# Altium schematic sheet ESP32 Processor.SchDoc: ESP32 Microcontroller
size A4; Date: Dec. 29th, 2022; Author: Karl Asseily; DrawnBy: Karl Asseily; DocumentNumber: 202301140903; Revision: 1.2; SheetNumber: 11; SheetTotal: 20; Time: 07:56
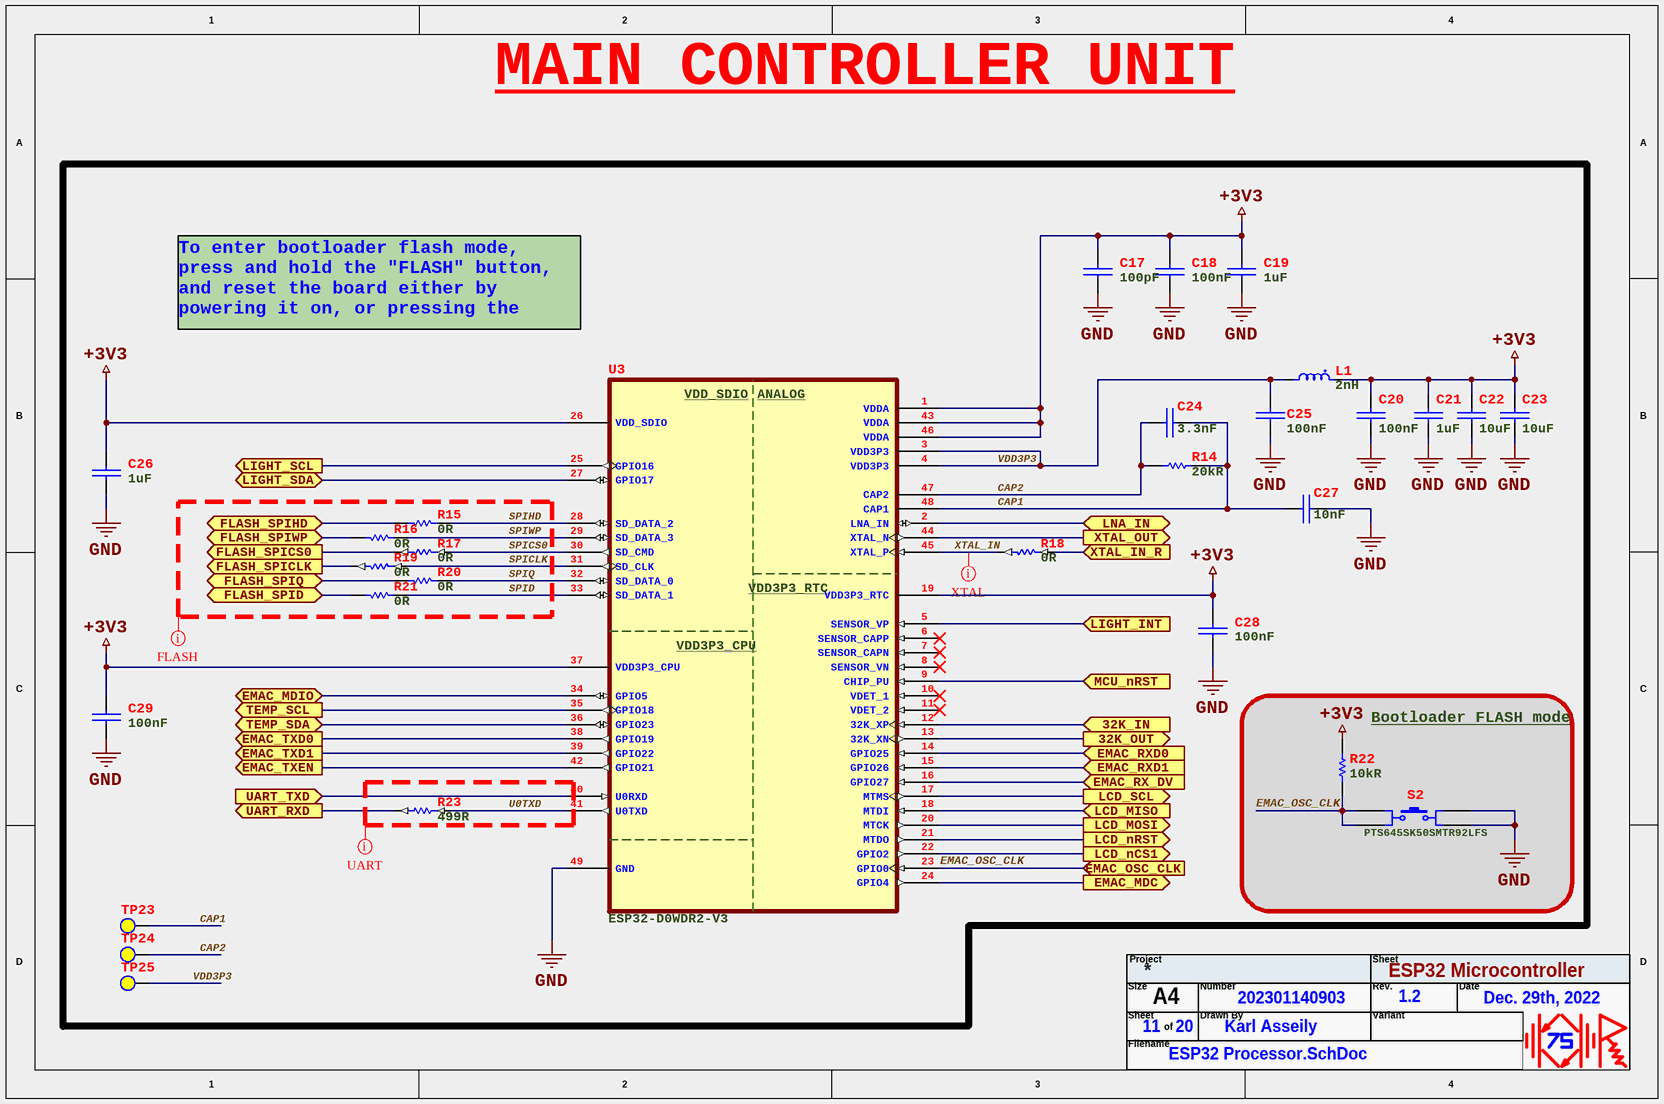
[diagram p0: ESP32 Processor.SchDoc]

## Parts
C17  100pF  [CAP_0603]
C18  100nF  [CAP_0603]
C19  1uF  [CAP_0805]
C20  100nF  [CAP_0603]
C21  1uF  [CAP_0805]
C22  10uF  [CAP_1206]
C23  10uF  [CAP_1206]
C24  3.3nF  [CAP_0603]
C25  100nF  [CAP_0603]
C26  1uF  [CAP_0805]
C27  10nF  [CAP_0603]
C28  100nF  [CAP_0603]
C29  100nF  [CAP_0603]
L1  2nH  [IND_0402]
R14  20kR  [RES_0603]
R15  0R  [RES_0603]
R16  0R  [RES_0603]
R17  0R  [RES_0603]
R18  0R  [RES_0603]
R19  0R  [RES_0603]
R20  0R  [RES_0603]
R21  0R  [RES_0603]
R22  10kR  [RES_0603]
R23  499R  [RES_0603]
S2  PTS645SK50SMTR92LFS  [SW_TACTILE-SPST_PTS645SK50SMTR92LFS_SMD]
TP23  CAP1  [TEST POINT PAD]  (value not drawn)  (no BOM)
TP24  CAP2  [TEST POINT PAD]  (value not drawn)  (no BOM)
TP25  VDD3P3  [TEST POINT PAD]  (value not drawn)  (no BOM)
U3  ESP32-D0WDR2-V3  [IC_QFN35P500X500X90-49N]

## Blocks framed on the sheet
Bootloader FLASH mode: R22 S2

## Ports
32K_IN (in, see Main Controller Unit, RTC Clock), 32K_OUT (out, see Main Controller Unit, RTC Clock), EMAC_MDC (out, see Main Controller Unit, Ethernet Controller, Main Controller Unit), EMAC_MDIO (bidir, see Main Controller Unit, Ethernet Controller, Main Controller Unit), EMAC_OSC_CLK (in, see Main Controller Unit, Ethernet Controller, Main Controller Unit), EMAC_RX_DV (in, see Main Controller Unit, Ethernet Controller, Main Controller Unit), EMAC_RXD0 (in, see Main Controller Unit, Ethernet Controller, Main Controller Unit), EMAC_RXD1 (in, see Main Controller Unit, Ethernet Controller, Main Controller Unit), EMAC_TXD0 (out, see Main Controller Unit, Ethernet Controller, Main Controller Unit), EMAC_TXD1 (out, see Main Controller Unit, Ethernet Controller, Main Controller Unit), EMAC_TXEN (out, see Main Controller Unit, Ethernet Controller, Main Controller Unit), FLASH_SPICLK (out, see Main Controller Unit, Flash Memory), FLASH_SPICS0 (out, see Main Controller Unit, Flash Memory), FLASH_SPID (bidir, see Main Controller Unit, Flash Memory), FLASH_SPIHD (bidir, see Main Controller Unit, Flash Memory), FLASH_SPIQ (bidir, see Main Controller Unit, Flash Memory), FLASH_SPIWP (bidir, see Main Controller Unit, Flash Memory), LCD_MISO (in, see Main Controller Unit, LCD Display, Main Controller Unit), LCD_MOSI (out, see Main Controller Unit, LCD Display, Main Controller Unit), LCD_nCS1 (out, see Main Controller Unit, LCD Display, Main Controller Unit), LCD_nRST (out, see Main Controller Unit, LCD Display, Main Controller Unit), LCD_SCL (out, see Main Controller Unit, LCD Display, Main Controller Unit), LIGHT_INT (in, see Main Controller Unit, Light and Proximity Sensor, Main Controller Unit), LIGHT_SCL (out, see Main Controller Unit, Light and Proximity Sensor, Main Controller Unit), LIGHT_SDA (bidir, see Main Controller Unit, Light and Proximity Sensor, Main Controller Unit), LNA_IN (bidir, see Main Controller Unit, RF Antenna), MCU_nRST (in, see Main Controller Unit, Voltage Supervisor), TEMP_SCL (out, see Main Controller Unit, Temp and Humidity Sensor), TEMP_SDA (bidir, see Main Controller Unit, Temp and Humidity Sensor), UART_RXD (out, see Main Controller Unit, USB-to-Serial Converter), UART_TXD (in, see Main Controller Unit, USB-to-Serial Converter), XTAL_IN_R (in, see Main Controller Unit, CPU Clock), XTAL_OUT (out, see Main Controller Unit, CPU Clock)

## Nets
+3V3: C17.1 C18.1 C19.1 C20.1 C21.1 C22.1 C23.1 C26.1 C28.1 C29.1 L1.1 R22.2 U3.1(VDDA) U3.19(VDD3P3_RTC) U3.26(VDD_SDIO) U3.37(VDD3P3_CPU) U3.43(VDDA) U3.46(VDDA)
GND: C17.2 C18.2 C19.2 C20.2 C21.2 C22.2 C23.2 C25.2 C26.2 C27.2 C28.2 C29.2 S2.3 S2.4 U3.49(GND)
32K_IN: U3.12(32K_XP) ; port 32K_IN
32K_OUT: U3.13(32K_XN) ; port 32K_OUT
CAP1: C24.2 C27.1 R14.2 TP23.TP U3.48(CAP1)
CAP2: C24.1 R14.1 TP24.TP U3.47(CAP2)
EMAC_MDC: U3.24(GPIO4) ; port EMAC_MDC
EMAC_MDIO: U3.34(GPIO5) ; port EMAC_MDIO
EMAC_OSC_CLK: R22.1 S2.1 S2.2 U3.23(GPIO0) ; port EMAC_OSC_CLK
EMAC_RX_DV: U3.16(GPIO27) ; port EMAC_RX_DV
EMAC_RXD0: U3.14(GPIO25) ; port EMAC_RXD0
EMAC_RXD1: U3.15(GPIO26) ; port EMAC_RXD1
EMAC_TXD0: U3.38(GPIO19) ; port EMAC_TXD0
EMAC_TXD1: U3.39(GPIO22) ; port EMAC_TXD1
EMAC_TXEN: U3.42(GPIO21) ; port EMAC_TXEN
FLASH_SPICLK: R19.1 ; port FLASH_SPICLK
FLASH_SPICS0: R17.1 ; port FLASH_SPICS0
FLASH_SPID: R21.1 ; port FLASH_SPID
FLASH_SPIHD: R15.1 ; port FLASH_SPIHD
FLASH_SPIQ: R20.1 ; port FLASH_SPIQ
FLASH_SPIWP: R16.1 ; port FLASH_SPIWP
LCD_MISO: U3.18(MTDI) ; port LCD_MISO
LCD_MOSI: U3.20(MTCK) ; port LCD_MOSI
LCD_nCS1: U3.22(GPIO2) ; port LCD_nCS1
LCD_nRST: U3.21(MTDO) ; port LCD_nRST
LCD_SCL: U3.17(MTMS) ; port LCD_SCL
LIGHT_INT: U3.5(SENSOR_VP) ; port LIGHT_INT
LIGHT_SCL: U3.25(GPIO16) ; port LIGHT_SCL
LIGHT_SDA: U3.27(GPIO17) ; port LIGHT_SDA
LNA_IN: U3.2(LNA_IN) ; port LNA_IN
MCU_nRST: U3.9(CHIP_PU) ; port MCU_nRST
SPICLK: R19.2 U3.31(SD_CLK)
SPICS0: R17.2 U3.30(SD_CMD)
SPID: R21.2 U3.33(SD_DATA_1)
SPIHD: R15.2 U3.28(SD_DATA_2)
SPIQ: R20.2 U3.32(SD_DATA_0)
SPIWP: R16.2 U3.29(SD_DATA_3)
TEMP_SCL: U3.35(GPIO18) ; port TEMP_SCL
TEMP_SDA: U3.36(GPIO23) ; port TEMP_SDA
U0TXD: R23.2 U3.41(U0TXD)
UART_RXD: R23.1 ; port UART_RXD
UART_TXD: U3.40(U0RXD) ; port UART_TXD
VDD3P3: C25.1 L1.2 TP25.TP U3.3(VDD3P3) U3.4(VDD3P3)
XTAL_IN: R18.1 U3.45(XTAL_P)
XTAL_IN_R: R18.2 ; port XTAL_IN_R
XTAL_OUT: U3.44(XTAL_N) ; port XTAL_OUT

Not connected (* = marked no-connect by the designer): U3 6(SENSOR_CAPP)* 7(SENSOR_CAPN)* 8(SENSOR_VN)* 10(VDET_1)* 11(VDET_2)*

## Layout directives
net class FLASH; rule Impedance Constraint [Min = 49.00    Max = 51.00    ]; rule Matched Net Lengths [Delay Tolerance = 5ps]; rule Length Constraint [Min Delay = 0ps    Max Delay = 200ps]: SPICLK, SPICS0, SPID, SPIHD, SPIQ, SPIWP
net class UART; rule Impedance Constraint [Min = 49.00    Max = 51.00    ]; rule Matched Net Lengths [Delay Tolerance = 5ps]: U0TXD
net class XTAL; rule Maximum Via Count Constraint [Max Count = 0]: XTAL_IN

## Notes on the sheet
- MAIN CONTROLLER UNIT
- To enter bootloader flash mode, press and hold the "FLASH" button, and reset the board either by powering it on, or pressing the Reset button.
- Project
- Sheet
- Size
- Filename
- A4
- of
- Number
- Drawn By
- Rev.
- Variant
- Date
- (in symbol IC_ESP32-D0WDR2-V3) ANALOG

## Library data of the parts
C17 = CAP_100pF-50V-10%_0603: 100 pF ±10% 50V Ceramic Capacitor X7R 0603 (1608 Metric); Manufacturer: Yageo; Manufacturer Part Number: CC0603KRX7R9BB101; Insulation Resistance: 100GR; Supplier 1: Digi-Key; RoHS: Yes; Category: Ceramic Capacitors; Stock 1: 454408; Pricing 1: 1=0.10000, 10=0.04800, 50=0.02620, 100=0.02140, 500=0.01528, 1000=0.01200 (USD); Mounting Technology: Surface Mount; Case/Package: 0603; Pins: 2; Case Code (Imperial): 0603; Case Code (Metric): 1608; Min Operating Temperature: -55°C; Max Operating Temperature: 125°C; Capacitance: 100pF; Tolerance: 10%; Dielectric: X7R; Voltage Rating (DC): 50V; Packaging: Tape and Reel; Voltage Rating: 50V; Package Quantity: 4000; Termination: SMD/SMT; Voltage: 50V; Series: CC; Length: 1.6mm; Width: 0.031inch; Height: 0.8mm; Thickness: 0.035inch; Depth: 0.8mm; Radiation Hardening: No; RoHS Compliant: Yes; Reach SVHC Compliant: Yes; Lead Free: Lead Free; Halogen Free: Halogen Free; ComponentLink1URL: C:\Users\Public\Documents\Altium\Projects\Cellar_Watchdog\Docs\Capacitor\UPY-GPHC_X7R_6.3V-to-250V_22.pdf; ComponentLink1Description: Datasheet; Supplier 2: Mouser; Supplier Part Number 1: 311-3601-1-ND; Supplier Part Number 2: 603-CC603KRX7R9BB101
C18 C20 C25 C28 C29 = CAP_0.1uF-50V-10%_0603: 0.1 µF ±10% 50V Ceramic Capacitor X7R 0603 (1608 Metric); Manufacturer: Yageo; Manufacturer Part Number: CC0603KRX7R9BB104; Supplier 1: Digi-Key; RoHS: Yes; Category: Ceramic Capacitors; Stock 1: 10054527; Pricing 1: 1=0.10000, 10=0.05400, 50=0.02960, 100=0.02430, 500=0.01732, 1000=0.01361 (USD); Mounting Technology: Surface Mount; Case/Package: 0603; Pins: 2; Case Code (Metric): 1608; Case Code (Imperial): 0603; Dielectric Material: Ceramic; Min Operating Temperature: -55°C; Max Operating Temperature: 125°C; Package Quantity: 1; Capacitance: 100nF; Voltage Rating: 50V; Tolerance: 10%; Packaging: Tape and Reel; Dielectric: X7R; Termination: SMD/SMT; Voltage: 50V; Series: CC; Length: 0.063inch; Width: 0.031inch; Height: 0.8mm; Thickness: 0.035inch; Depth: 0.8mm; Radiation Hardening: No; Reach SVHC Compliant: Yes; Lead Free: Lead Free; Halogen Free: Halogen Free; RoHS Compliant: Yes; ComponentLink1URL: C:\Users\Public\Documents\Altium\Projects\Cellar_Watchdog\Docs\Capacitor\UPY-GPHC_X7R_6.3V-to-250V_22.pdf; ComponentLink1Description: Datasheet; Supplier Part Number 2: 603-CC603KRX7R9BB104; Supplier Part Number 1: 311-1344-1-ND; Supplier 2: Mouser
C19 C21 C26 = CAP_1uF-16V-10%_0603: 1 µF ±10% 16V Ceramic Capacitor X7R 0603 (1608 Metric); Manufacturer: Yageo; Manufacturer Part Number: CC0603KRX7R7BB105; Dissipation Factor: 5%; Supplier 1: Digi-Key; RoHS: Yes; Category: Ceramic Capacitors; Stock 1: 10491943; Pricing 1: 1=0.14000, 10=0.09800, 50=0.05560, 100=0.04610, 500=0.03234, 1000=0.02678 (USD); Mounting Technology: Surface Mount; Case/Package: 0603; Pins: 2; Case Code (Metric): 1608; Case Code (Imperial): 0603; Min Operating Temperature: -55°C; Max Operating Temperature: 125°C; Capacitance: 1uF; Tolerance: 10%; Dielectric: X7R; Voltage Rating: 16V; Package Quantity: 1; Packaging: Tape and Reel; Voltage Rating (DC): 16V; Termination: SMD/SMT; Resistor Type: Ceramic; Voltage: 16V; Series: CC; Construction: Flat; Length: 1.6mm; Width: 0.031inch; Height: 0.8mm; Thickness: 0.035inch; Depth: 0.8mm; Radiation Hardening: No; Lead Free: Lead Free; Halogen Free: Halogen Free; RoHS Compliant: Yes; ComponentLink1URL: C:\Users\Public\Documents\Altium\Projects\Cellar_Watchdog\Docs\Capacitor\UPY-GPHC_X7R_6.3V-to-250V_22.pdf; ComponentLink1Description: Datasheet; Supplier 2: Mouser; Supplier Part Number 1: 311-1446-1-ND; Supplier Part Number 2: 603-CC603KRX7R7BB105
C22 C23 = CAP_10uF-25V-10%_1206: 10 µF ±10% 25V Ceramic Capacitor X7R 1206 (3216 Metric); Manufacturer: Yageo; Manufacturer Part Number: CC1206KKX7R8BB106; Supplier 1: Digi-Key; RoHS: Yes; Category: Ceramic Capacitors; Stock 1: 67513; Pricing 1: 1=0.51000, 10=0.35100, 50=0.24580, 100=0.21070, 500=0.15806, 1000=0.13347 (USD); Mounting Technology: Surface Mount; Case/Package: 1206; Case Code (Imperial): 1206; Case Code (Metric): 3216; Weight: 0.000571oz; Min Operating Temperature: -55°C; Max Operating Temperature: 125°C; Capacitance: 10uF; Tolerance: 10%; Dielectric: X7R; Packaging: Tape and Reel; Voltage Rating (DC): 25V; Voltage Rating: 25V; Termination: SMD/SMT; Resistor Type: Ceramic; Series: CC; Construction: Flat; Length: 3.2mm; Width: 1.6mm; Depth: 1.6mm; Thickness: 0.071inch; Radiation Hardening: No; Lead Free: Lead Free; Halogen Free: Halogen Free; RoHS Compliant: Yes; Supplier 2: Mouser; ComponentLink1Description: Datasheet; ComponentLink1URL: C:\Users\Public\Documents\Altium\Projects\Cellar_Watchdog\Docs\Capacitor\UPY-GPHC_X7R_6.3V-to-250V_22.pdf; Supplier Part Number 1: 311-1959-1-ND; Supplier Part Number 2: 603-CC126KKX7R8BB106
C24 = CAP_3.3nF-50V-10%_0603: 3300 pF ±10% 50V Ceramic Capacitor X7R 0603 (1608 Metric); Manufacturer: Yageo; Manufacturer Part Number: CC0603KRX7R9BB332; Dissipation Factor: 3%; Insulation Resistance: 100GR; Supplier 1: Digi-Key; RoHS: Yes; Category: Ceramic Capacitors; Stock 1: 541031; Pricing 1: 1=0.10000, 10=0.04600, 50=0.02480, 100=0.02030, 500=0.01450, 1000=0.01139 (USD); Mounting Technology: Surface Mount; Case/Package: 0603; Pins: 2; Case Code (Imperial): 0603; Case Code (Metric): 1608; Dielectric Material: Ceramic; Min Operating Temperature: -55°C; Max Operating Temperature: 125°C; Tolerance: 10%; Capacitance: 3.3nF; Dielectric: X7R; Package Quantity: 1; Voltage Rating: 50V; Voltage Rating (DC): 50V; Packaging: Tape and Reel; Termination: SMD/SMT; Resistor Type: Ceramic; Voltage: 50V; Series: CC; Length: 1.6mm; Width: 0.031inch; Height: 0.8mm; Thickness: 0.035inch; Depth: 0.8mm; Radiation Hardening: No; RoHS Compliant: Yes; Reach SVHC Compliant: Yes; Lead Free: Lead Free; Halogen Free: Halogen Free; ComponentLink1URL: C:\Users\Public\Documents\Altium\Projects\Cellar_Watchdog\Docs\Capacitor\UPY-GPHC_X7R_6.3V-to-250V_22.pdf; ComponentLink1Description: Datasheet; Supplier 2: Mouser; Supplier Part Number 1: 311-1082-1-ND; Supplier Part Number 2: 603-CC603KRX7R9BB332
C27 = CAP_10nF-50V-10%_0603: 10000 pF ±10% 50V Ceramic Capacitor X7R 0603 (1608 Metric); Manufacturer: Yageo; Manufacturer Part Number: CC0603KRX7R9BB103; Insulation Resistance: 100GR; Supplier 1: Digi-Key; RoHS: Yes; Category: Ceramic Capacitors; Stock 1: 8015125; Pricing 1: 1=0.10000, 10=0.03200, 50=0.01760, 100=0.01440, 500=0.01026, 1000=0.00805 (USD); Mounting Technology: Surface Mount; Case/Package: 0603; Pins: 2; Material: Ceramic; Case Code (Metric): 1608; Case Code (Imperial): 0603; Min Operating Temperature: -55°C; Max Operating Temperature: 125°C; Tolerance: 10%; Capacitance: 10nF; Dielectric: X7R; Voltage: 50V; Packaging: Tape and Reel; Voltage Rating: 50V; Voltage Rating (DC): 50V; Package Quantity: 1; Termination: SMD/SMT; Resistor Type: Ceramic; Series: CC; Length: 1.6mm; Width: 0.031inch; Height: 0.8mm; Thickness: 0.035inch; Depth: 0.8mm; Radiation Hardening: No; RoHS Compliant: Yes; Lead Free: Lead Free; Halogen Free: Halogen Free; ComponentLink1URL: C:\Users\Public\Documents\Altium\Projects\Cellar_Watchdog\Docs\Capacitor\UPY-GPHC_X7R_6.3V-to-250V_22.pdf; ComponentLink1Description: Datasheet; Supplier 2: Mouser; Supplier Part Number 1: 311-1085-1-ND; Supplier Part Number 2: 603-CC603KRX7R9BB103
L1 = IND_2nH-900mA-10%_0402: 2 nH Unshielded Multilayer Inductor 900 mA 90mOhm Max 0402 (1005 Metric); Manufacturer: Murata; Manufacturer Part Number: LQG15HN2N0C02D; Supplier 1: Digi-Key; RoHS: Yes; Category: Fixed Inductors; Stock 1: 197887; Pricing 1: 1=0.10000, 10=0.06400, 25=0.05640, 50=0.04800, 100=0.04240, 250=0.03888, 500=0.03536, 1000=0.02969, 2500=0.02545 (USD); RoHS Compliant: Yes; Supplier 2: Mouser; Supplier Part Number 1: 490-15076-1-ND; Supplier Part Number 2: 81-LQG15HN2N0C02D; Inductance: 2nH; ComponentLink1Description: Datasheet; ComponentLink1URL: C:\Users\Public\Documents\Altium\Projects\Cellar_Watchdog\Docs\Inductor\JELF243B-0009.pdf
R14 = RES_20kR-100mW-1%_0603: 20 kOhms ±1% 0.1W, 1/10W Chip Resistor 0603 (1608 Metric) Moisture Resistant Thick Film; Manufacturer: Yageo; Manufacturer Part Number: RC0603FR-0720KL; Temperature Coefficient: 100ppm/°C; Voltage Rating (DC): 50V; Power Rating: 100mW; Supplier 1: Digi-Key; RoHS: Yes; Category: Chip SMD Resistors; Stock 1: 8523666; Pricing 1: 1=0.10000, 10=0.02100, 100=0.00850, 1000=0.00383, 2500=0.00332 (USD); Case/Package: 0603; Number of Pins: 2; Case Code (Imperial): 0603; Case Code (Metric): 1608; Size Code: 0603; Min Operating Temperature: -55°C; Max Operating Temperature: 155°C; Tolerance: 1%; Packaging: Tape and Reel; Resistance: 20kR; Resistor Type: Thick Film; Voltage Rating: 50V; Package Quantity: 1; Termination: SMD/SMT; Number of Terminations: 2; Max Power Dissipation: 100mW; Features: Moisture Resistant; Series: RC; Technology: THICK FILM; Construction: Rectangular; Resistance Tolerance: 1%; Length: 0.063inch; Width: 0.031inch; Height: 0.022inch; Depth: 0.8mm; Lead Free: Lead Free; RoHS Compliant: Yes; Reach SVHC Compliant: Yes; Military Standard: Not; ComponentLink1URL: C:\Users\Public\Documents\Altium\Projects\Cellar_Watchdog\Docs\Resistor\PYu-RC_Group_51_RoHS_L_12.pdf; ComponentLink1Description: Datasheet; Supplier 2: Mouser; Supplier Part Number 1: 311-20.0KHRCT-ND; Supplier Part Number 2: 603-RC0603FR-0720KL
R15-R21 = RES_0R-100mW-1%_0603: 0 Ohms Jumper Chip Resistor 0603 (1608 Metric) Moisture Resistant Thick Film; Manufacturer: Yageo; Manufacturer Part Number: RC0603FR-070RL; Power Rating: 100mW; Tolerance: 1%; Voltage Rating (DC): 50V; Temperature Coefficient: 200ppm/°C; Current Rating: 1A; Working Voltage: 75V; Supplier 1: Digi-Key; RoHS: Yes; Category: Chip SMD Resistors; Stock 1: 4158752; Pricing 1: 1=0.10000, 10=0.01800, 25=0.01320, 50=0.01000, 100=0.00730, 250=0.00560, 500=0.00448, 1000=0.00329 (USD); Case/Package: 0603; Number of Pins: 2; Contact Plating: Tin,Matte; Case Code (Metric): 1608; Case Code (Imperial): 0603; Min Operating Temperature: -55°C; Max Operating Temperature: 155°C; Resistance: 0R; Packaging: Tape and Reel; Resistor Type: Thick Film; Package Quantity: 5000; Voltage Rating: 50V; Number of Terminations: 2; Termination: SMD/SMT; Max Power Dissipation: 100mW; Features: Moisture Resistant; Series: RC; Construction: Rectangular; Resistance Tolerance: 1%; Technology: THICK FILM; Length: 1.6mm; Width: 0.8mm; Height: 0.45mm; Depth: 0.8mm; Radiation Hardening: No; Reach SVHC Compliant: Yes; Lead Free: Lead Free; RoHS Compliant: Yes; Military Standard: Not; ComponentLink7URL: C:\Users\Public\Documents\Altium\Projects\Cellar_Watchdog\Docs\Resistor\PYu-RC_Group_51_RoHS_L_12.pdf; ComponentLink7Description: Datasheet; Supplier 2: Mouser; Supplier Part Number 2: 603-RC0603FR-070RL; Supplier Part Number 1: 311-0.0HRCT-ND
R22 = RES_10kR-100mW-1%_0603: 10 kOhms ±1% 0.1W, 1/10W Chip Resistor 0603 (1608 Metric) Moisture Resistant Thick Film; Manufacturer: Yageo; Manufacturer Part Number: RC0603FR-0710KL; Temperature Coefficient: 100ppm/°C; Voltage Rating (DC): 50V; Power Rating: 100mW; Voltage Rating: 75V; Supplier 1: Digi-Key; RoHS: Yes; Category: Chip SMD Resistors; Stock 1: 43209622; Pricing 1: 1=0.10000, 10=0.02100, 100=0.00850, 1000=0.00383, 2500=0.00332 (USD); Case/Package: 0603; Pins: 2; Case Code (Imperial): 0603; Case Code (Metric): 1608; Weight: 7.1E-05oz; Min Operating Temperature: -55°C; Max Operating Temperature: 155°C; Tolerance: 1%; Resistor Type: Thick Film; Resistance: 10kR; Packaging: Tape and Reel; Termination: SMD/SMT; Features: Moisture Resistant; Series: RC; Max Power Dissipation: 100mW; Number of Terminations: 2; Resistance Tolerance: 1%; Construction: Rectangular; Length: 1.6mm; Width: 0.8mm; Height: 0.45mm; Depth: 0.8mm; Lead Pitch: 0.3mm; Reach SVHC Compliant: Yes; Lead Free: Lead Free; Military Standard: Not; RoHS Compliant: Yes; ComponentLink6URL: C:\Users\Public\Documents\Altium\Projects\Cellar_Watchdog\Docs\Resistor\PYu-RC_Group_51_RoHS_L_12.pdf; ComponentLink6Description: Datasheet; Supplier 2: Mouser; Supplier Part Number 1: 311-10.0KHRCT-ND; Supplier Part Number 2: 603-RC0603FR-0710KL
R23 = RES_499R-100mW-1%_0603: 499 Ohms ±1% 0.1W, 1/10W Chip Resistor 0603 (1608 Metric) Moisture Resistant Thick Film; Manufacturer: Yageo; Manufacturer Part Number: RC0603FR-07499RL; Temperature Coefficient: 100ppm/°C; Power Rating: 100mW; Voltage Rating: 50V; Supplier 1: Digi-Key; RoHS: Yes; Category: Chip SMD Resistors; Stock 1: 1801383; Pricing 1: 1=0.10000, 10=0.02100, 100=0.00850, 1000=0.00383, 2500=0.00332 (USD); Mounting Technology: Surface Mount; Case/Package: 0603; Contact Plating: Tin,Matte; Case Code (Metric): 1608; Case Code (Imperial): 0603; Min Operating Temperature: -55°C; Max Operating Temperature: 155°C; Resistance: 499R; Tolerance: 1%; Resistor Type: Thick Film; Package Quantity: 1; Packaging: Tape and Reel; Number of Terminations: 2; Termination: SMD/SMT; Max Power Dissipation: 100mW; Voltage Rating (DC): 50V; Features: Moisture Resistant; Series: RC; Construction: Rectangular; Technology: THICK FILM; Length: 1.6mm; Width: 0.031inch; Height: 0.45mm; Depth: 0.8mm; Radiation Hardening: No; Military Standard: Not; Lead Free: Lead Free; RoHS Compliant: Yes; ComponentLink1URL: C:\Users\Public\Documents\Altium\Projects\Cellar_Watchdog\Docs\Resistor\PYu-RC_Group_51_RoHS_L_12.pdf; ComponentLink1Description: Datasheet; Supplier 2: Mouser; Supplier Part Number 1: 311-499HRCT-ND; Supplier Part Number 2: 603-RC0603FR-07499RL
S2 = SW4-NO-SPST_PTS645SK50SMTR92LFS_SMD: Tactile Switch SPST-NO Top Actuated Surface Mount; Manufacturer: ITT C&K; Mechanical Life: 100000Cycles; Actuator Material: Nylon,Polyamide,PA66; Operating Force: 260gf; Throw Configuration: SPST; Max Voltage Rating (DC): 12V; Current Rating: 50mA; Contact Resistance: 100mR; Illumination Type: Non-Illuminated,Illuminated; Switch Function: Off-Mom; Actuator Type: Standard; Actuator Length: 1.55mm; Supplier 1: Digi-Key; Manufacturer Part Number: PTS645SK50SMTR92LFS; RoHS: Yes; Category: Tactile Switches; Stock 1: 267139; Pricing 1: 1=0.26000, 10=0.25100, 25=0.23840, 100=0.21580, 250=0.19676, 500=0.18288 (USD); Mount: Surface Mount; Case/Package: SMD/SMT; Contact Plating: Silver; Contact Material: Bronze; Color: Red; Min Operating Temperature: -20°C; Max Operating Temperature: 60°C; Packaging: Tape and Reel; Termination: Gull Wing; Voltage Rating (DC): 12V; Package Quantity: 1; Max Current Rating: 50mA; Orientation: Straight; Series: PTS645; Length: 6mm; Depth: 9mm; REACH SVHC: No SVHC; Lead Free: Lead Free; RoHS Compliant: Yes; ComponentLink1URL: C:\Users\Public\Documents\Altium\Projects\Cellar_Watchdog\Docs\Switch\pts645.pdf; ComponentLink1Description: Datasheet; Supplier 2: Mouser; Supplier Part Number 1: CKN9087CT-ND; Supplier Part Number 2: 611-PTS645SK50SMTR92
TP23-TP25 = Test Point: PCB Test Point; ClassName: Test Point
  TP23: Value: CAP1
  TP24: Value: CAP2
  TP25: Value: VDD3P3
U3 = IC_ESP32-D0WDR2-V3: IC RF TxRx + MCU Bluetooth, WiFi 802.11b/g/n, Bluetooth v4.2 + EDR, Class 1, 2 and 3 2.4GHz 48-VFQFN Exposed Pad; Manufacturer: Espressif Systems; Supplier 1: Digi-Key; Manufacturer Part Number: ESP32-D0WDR2-V3; RoHS: No; Stock 1: 4998; Pricing 1: 1=3.92000, 10=3.50000, 25=3.15000, 100=2.87000, 250=2.59000, 500=2.32400, 1000=2.10000 (USD); Supplier 2: Mouser; Supplier Part Number 2: 356-ESP32-D0WDR2-V3; Supplier Part Number 1: 1904-ESP32-D0WDR2-V3CT-ND; ComponentLink1Description: Datasheet; ComponentLink1URL: C:\Users\Public\Documents\Altium\Projects\Cellar_Watchdog\Docs\MCU\esp32_datasheet_en.pdf; ComponentLink2Description: Technical Reference Manual; ComponentLink2URL: C:\Users\Public\Documents\Altium\Projects\Cellar_Watchdog\Docs\MCU\esp32_technical_reference_manual_en.pdf; ComponentLink3Description: Hardware Design Guidelines; ComponentLink3URL: C:\Users\Public\Documents\Altium\Projects\Cellar_Watchdog\Docs\MCU\esp32_hardware_design_guidelines_en.pdf